# EAGLE schematic ecgdesign4 (EAGLE 9.3.0)
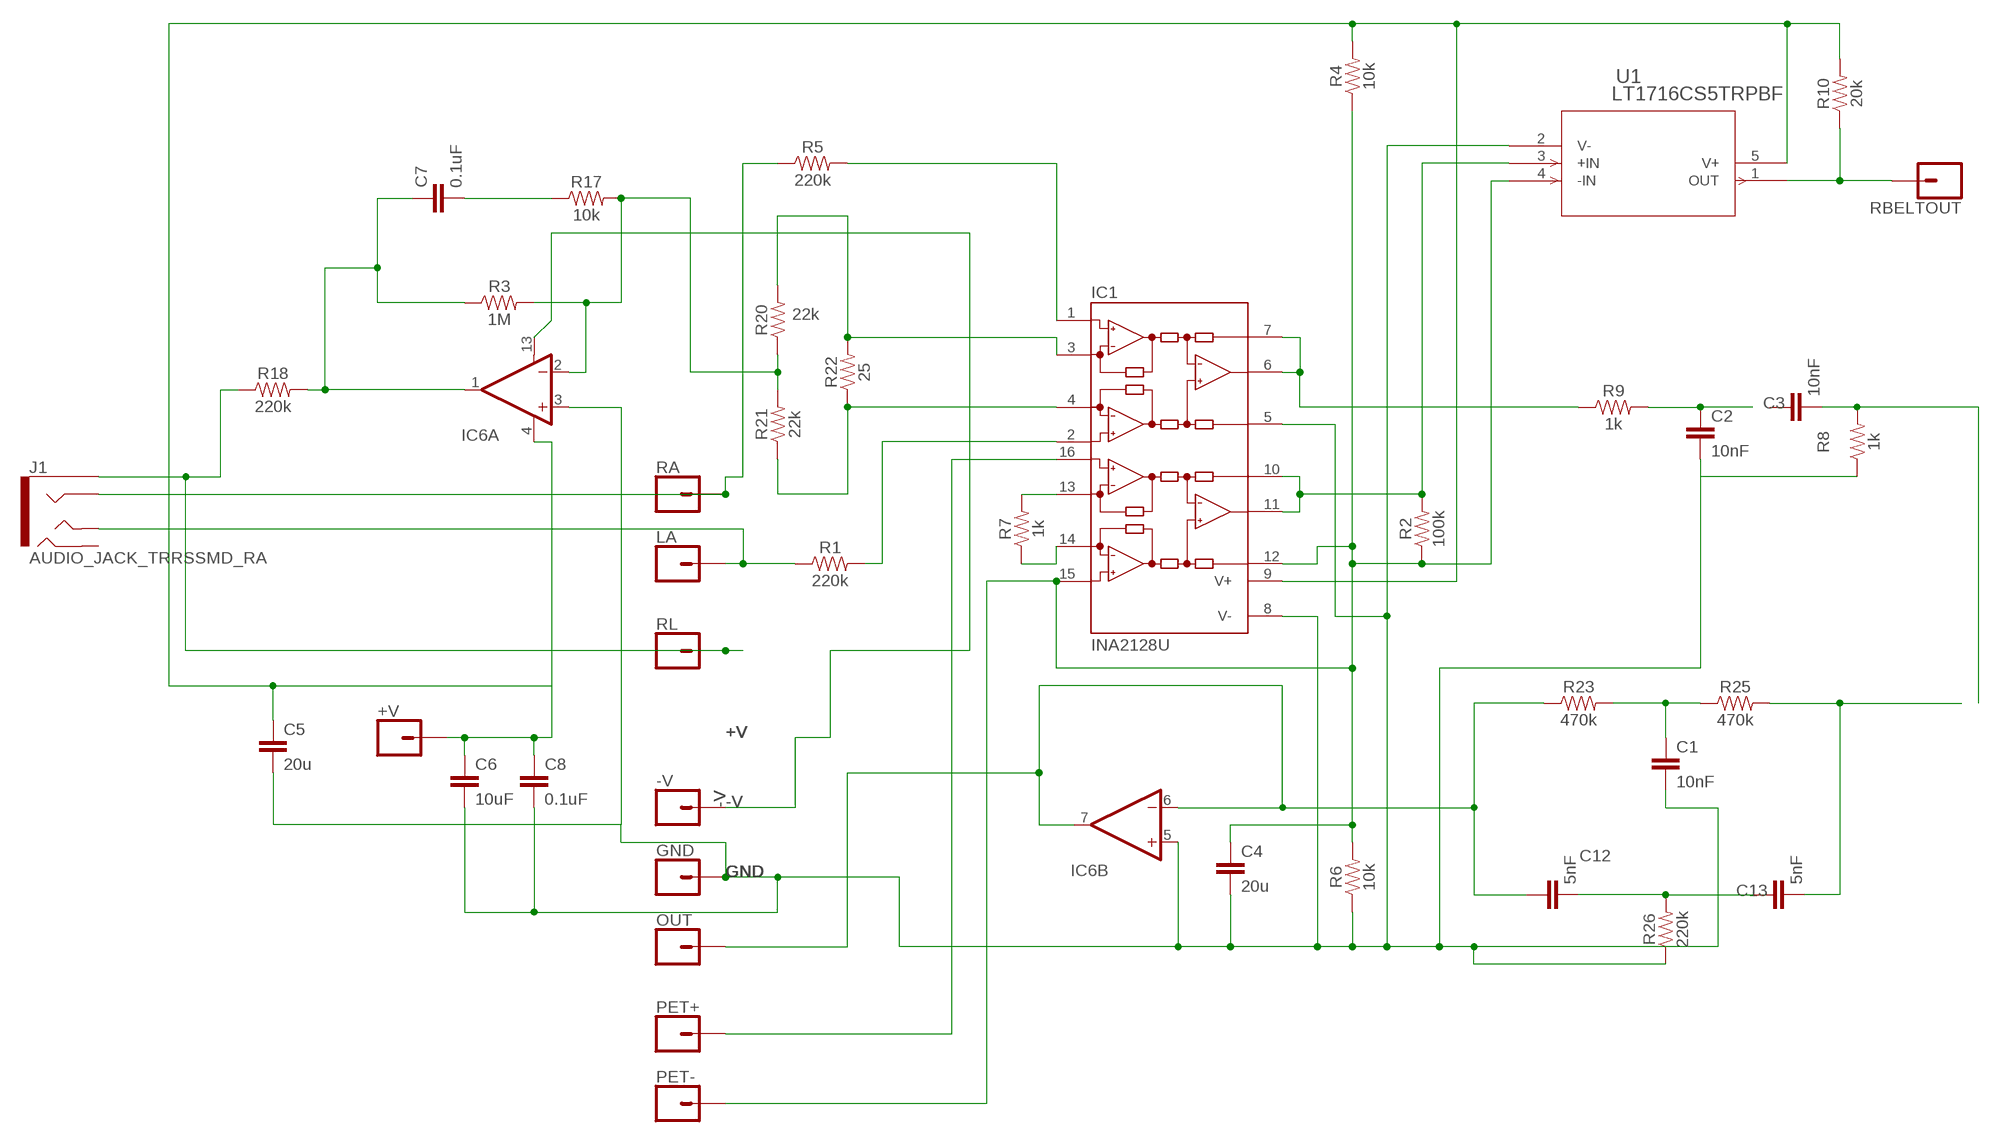
[diagram p0: schematic, sheet 1]

## Parts
+V  CONN_01  [1X01]
-V  CONN_01  [1X01]
C1  10nF  10NF-PTH-10MM-10000V-1-%  [CAP-PTH-10MM]
C2  10nF  10NF-PTH-10MM-10000V-1-%  [CAP-PTH-10MM]
C3  10nF  10NF-PTH-10MM-10000V-1-%  [CAP-PTH-10MM]
C4  20u  C37/20  [C37.5B20]
C5  20u  C37/20  [C37.5B20]
C6  10uF  10NF-PTH-10MM-10000V-1-%  [CAP-PTH-10MM]
C7  0.1uF  10NF-PTH-10MM-10000V-1-%  [CAP-PTH-10MM]
C8  0.1uF  10NF-PTH-10MM-10000V-1-%  [CAP-PTH-10MM]
C12  5nF  10NF-PTH-10MM-10000V-1-%  [CAP-PTH-10MM]
C13  5nF  10NF-PTH-10MM-10000V-1-%  [CAP-PTH-10MM]
GND  CONN_01  [1X01]
IC1  INA2128U  [SO16-1]
IC6  OPA4336E  [SSOP16BU]
J1  AUDIO_JACK_TRRSSMD_RA  [AUDIO_JACK_3.5MM_TRRS_SMD_RA]
LA  CONN_01  [1X01]
OUT  CONN_01  [1X01]
PET+  CONN_01  [1X01]
PET-  CONN_01  [1X01]
R1  220k  10KOHM-HORIZ-1/4W-1%  [AXIAL-0.3]
R2  100k  10KOHM-HORIZ-1/4W-1%  [AXIAL-0.3]
R3  1M  10KOHM-HORIZ-1/4W-1%  [AXIAL-0.3]
R4  10k  10KOHM-HORIZ-1/4W-1%  [AXIAL-0.3]
R5  220k  10KOHM-HORIZ-1/4W-1%  [AXIAL-0.3]
R6  10k  10KOHM-HORIZ-1/4W-1%  [AXIAL-0.3]
R7  1k  10KOHM-HORIZ-1/4W-1%  [AXIAL-0.3]
R8  1k  1KOHM-HORIZ-1/4W-1%  [AXIAL-0.3]
R9  1k  1KOHM-HORIZ-1/4W-1%  [AXIAL-0.3]
R10  20k  10KOHM-HORIZ-1/4W-1%  [AXIAL-0.3]
R17  10k  1KOHM-HORIZ-1/4W-5%  [AXIAL-0.3]
R18  220k  1KOHM-HORIZ-1/4W-5%  [AXIAL-0.3]
R20  22k  1KOHM-HORIZ-1/4W-5%  [AXIAL-0.3]
R21  22k  1KOHM-HORIZ-1/4W-5%  [AXIAL-0.3]
R22  25  1KOHM-HORIZ-1/4W-5%  [AXIAL-0.3]
R23  470k  1KOHM-HORIZ-1/4W-5%  [AXIAL-0.3]
R25  470k  1KOHM-HORIZ-1/4W-5%  [AXIAL-0.3]
R26  220k  1KOHM-HORIZ-1/4W-5%  [AXIAL-0.3]
RA  CONN_01  [1X01]
RBELTOUT  CONN_01  [1X01]
RL  CONN_01  [1X01]
U1  LT1716CS5TRPBF  [SOT-5_S]

## Nets
+V: +V.1 C5.1 C6.1 C8.1 IC1.9(V+) IC6.4(A:V+) R4.P$2 R10.P$2 U1.5(V+)
-V: -V.1 IC6.13(A:V-)
GND: C1.2 C2.2 C4.2 C5.2 C6.2 C8.2 GND.1 IC1.5(REFA) IC1.8(V-) IC6.3(A:+IN) IC6.5(B:+IN) R6.P$1 R8.P$1 R26.P$1 U1.2(V-)
LAA: IC1.2(INA+) R1.P$2
N$1: IC1.14(RGB) R7.P$1
N$2: J1.TIP LA.1 R1.P$1
N$3: C7.2 R17.P$1
N$4: IC1.6(VOA) IC1.7(SENSEA) R9.P$1
N$5: C7.1 IC6.1(A:OUT) R3.P$1 R18.P$2
N$6: IC6.2(A:-IN) R3.P$2 R17.P$2 R20.P$1 R21.P$2
N$7: C12.2 C13.1 R26.P$2
N$8: IC1.4(RGA) R21.P$1 R22.P$1
N$9: C2.1 R9.P$2
N$10: IC1.1(INA-) R5.P$2
N$11: C3.2 R8.P$2
N$12: IC1.13(RGB) R7.P$2
N$13: IC1.10(SENSEB) IC1.11(VOB) R2.P$2 U1.3(+IN)
N$14: C4.1 IC1.12(REFB) IC1.15(INB+) PET-.1 R2.P$1 R4.P$1 R6.P$2 U1.4(-IN)
N$15: J1.EARTH R18.P$1 RL.1
N$16: C1.1 R23.P$2 R25.P$1
N$17: IC1.16(INB-) PET+.1
N$18: C13.2 R25.P$2
N$19: J1.RING1 R5.P$1 RA.1
N$22: R10.P$1 RBELTOUT.1 U1.1(OUT)
N$23: IC1.3(RGA) R20.P$2 R22.P$2
OUT: C12.1 IC6.6(B:-IN) IC6.7(B:OUT) OUT.1 R23.P$1
Unconnected: C3.1 IC6.10(C:OUT) IC6.11(C:-IN) IC6.12(C:+IN) IC6.14(D:+IN) IC6.15(D:-IN) IC6.16(D:OUT) J1.RING2

## Library data of the parts
+V -V GND LA OUT PET+ PET- RA RBELTOUT RL = SparkFun-Connectors:CONN_01: Single connection point. Often used as Generic Header-pin footprint for 0.1 inch spaced/style header connections On any of the 0.1 inch spaced packages, you can populate with these: Break Away Headers - Straight <https://www.sparkfun.com/products/116> (PRT-00116) Break Away Male Headers - Right Angle <https://www.sparkfun.com/products/553> (PRT-00553) Female Headers <https://www.sparkfun.com/products/115> (PRT-00115) Break Away Headers - Machine Pin <https://www.sparkfun.com/products/117> (PRT-00117) Break Away Female Headers - Swiss Machine Pin <https://www.sparkfun.com/products/743> (PRT-00743) This device is also useful as a general connection point to wire up your design to another part of your project. Our various solder wires solder well into these plated through hole pads. Hook-Up Wire - Assortment (Stranded, 22 AWG) <https://www.sparkfun.com/products/11375> (PRT-11375) Hook-Up Wire - Assortment (Solid Core, 22 AWG) <https://www.sparkfun.com/products/11367> (PRT-11367) View the entire wire category on our website here <https://www.sparkfun.com/categories/141> Special notes: SMTSO-256-ET is a "flush mount" nut for a 4-40 screw. We mostly use this on specialty testbeds; it is a nice way to connect hardware to your PCB at an adjustable hieght. Also note, the SNAP packages are for using a snappable style connector. We sell a baggie of snaps and they are also used on two LilyPad designs: Snap Assortment - 30 pack (male and female) <https://www.sparkfun.com/products/11347> (DEV-11347) LilyPad Arduino SimpleSnap <https://www.sparkfun.com/products/10941> (DEV-10941) LilyPad SimpleSnap Protoboard <https://www.sparkfun.com/products/10940> (DEV-10940)
C1-C3 = SparkFun-Capacitors:10NF: 0.01uF/10nF/10,000pF ceramic capacitors A capacitor is a passive two-terminal electrical component used to store electrical energy temporarily in an electric field. CAP-09321; PROD_ID: CAP-09321
C4 C5 = capacitor-wima:C: CAPACITOR naming: grid - package width
C6-C8 C12 C13 = SparkFun-Capacitors:10NF: 0.01uF/10nF/10,000pF ceramic capacitors A capacitor is a passive two-terminal electrical component used to store electrical energy temporarily in an electric field. CAP-09321; PROD_ID: CAP-09321; VALUE: 10nF
IC1 = burr-brown:INA2128: Dual Instrumentation Amplifier Low Power; MF: TEXAS INSTRUMENTS; MPN: INA2128U; OC_FARNELL: 1212421; OC_NEWARK: 28C7388
IC6 = burr-brown:OPA4336: Single-Supply, MicroPower CMOS Operational Amplifiers MicroAmplifier (TM) Series; MF: TEXAS INSTRUMENTS; MPN: OPA4336EA/250; OC_FARNELL: 1207060; OC_NEWARK: 74K3911
J1 = SparkFun-Connectors:AUDIO_JACK_TRRS: Audio Jack - 3.5mm TRRS (SMD) This is a 3.5mm TRRS SMD audio jack. TRRS connectors are the audio-style connectors that you see on some phones, MP3 players and development boards. TRRS stands for “tip, ring, ring, sleeve,” which reflects that this has three conductors and a ground. SparkFun Products: Audio Jack <https://www.sparkfun.com/products/12639> mbed Starter Kit <https://www.sparkfun.com/products/12968> SparkFun TRRS 3.5mm Jack Breakout <https://www.sparkfun.com/products/11570>; PROD_ID: CONN-10676; SF_ID: PRT-12639
R1-R3 R5 R7 R10 = SparkFun-Resistors:10KOHM: 10kΩ resistor A resistor is a passive two-terminal electrical component that implements electrical resistance as a circuit element. Resistors act to reduce current flow, and, at the same time, act to lower voltage levels within circuits. - Wikipedia; PROD_ID: RES-12183; VALUE: 10k
R4 R6 = SparkFun-Resistors:10KOHM: 10kΩ resistor A resistor is a passive two-terminal electrical component that implements electrical resistance as a circuit element. Resistors act to reduce current flow, and, at the same time, act to lower voltage levels within circuits. - Wikipedia; PROD_ID: RES-12183
R8 R9 = SparkFun-Resistors:1KOHM: 1kΩ resistor A resistor is a passive two-terminal electrical component that implements electrical resistance as a circuit element. Resistors act to reduce current flow, and, at the same time, act to lower voltage levels within circuits. - Wikipedia; PROD_ID: RES-12182
R17 R18 R20-R23 R25 R26 = SparkFun-Resistors:1KOHM: 1kΩ resistor A resistor is a passive two-terminal electrical component that implements electrical resistance as a circuit element. Resistors act to reduce current flow, and, at the same time, act to lower voltage levels within circuits. - Wikipedia; PROD_ID: RES-08380; VALUE: 1k
U1 = LT1716CS5TRPBF:LT1716CS5TRPBF; DESCRIPTION: LT1716 - SOT-23, 44V, Over-The-Top, Micropower, Precision Rail-to-Rail Comparator; DIGI-KEY_PART_NUMBER: LT1716CS5#TRPBFCT-ND; DIGI-KEY_PURCHASE_URL: https://www.digikey.com/product-detail/en/linear-technology-analog-devices/LT1716CS5-TRPBF/LT1716CS5-TRPBFCT-ND/7897918?utm_source=snapeda&utm_medium=aggregator&utm_campaign=symbol; MF: Linear Technology; MP: LT1716CS5#TRPBF; PACKAGE: TSOT-23 Linear Technology

## Net classes
0 default: width 0.381 mm, drill 0.076 mm